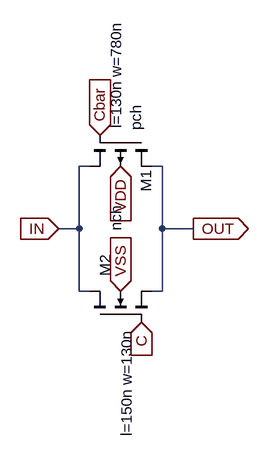
[diagram p0: schematic TG.asc]
TG.asc, the LTspice schematic file:
Version 4.1
SHEET 1 2188 680
WIRE 1920 -128 1904 -128
WIRE 2032 -128 2016 -128
WIRE 1904 -32 1904 -128
WIRE 1904 -32 1872 -32
WIRE 2032 -32 2032 -128
WIRE 2080 -32 2032 -32
WIRE 1904 64 1904 -32
WIRE 1920 64 1904 64
WIRE 2032 64 2032 -32
WIRE 2032 64 2016 64
FLAG 1936 -176 Cbar
IOPIN 1936 -176 In
FLAG 2000 112 C
IOPIN 2000 112 In
FLAG 1872 -32 IN
IOPIN 1872 -32 In
FLAG 2080 -32 OUT
IOPIN 2080 -32 Out
FLAG 1968 -128 VDD
IOPIN 1968 -128 In
FLAG 1968 64 VSS
IOPIN 1968 64 In
SYMBOL pmos4 2016 -176 R90
WINDOW 0 88 9 Right 2
WINDOW 3 -7 24 Right 2
WINDOW 123 -10 55 Right 2
SYMATTR InstName M1
SYMATTR Value pch
SYMATTR Value2 l=130n w=780n
SYMBOL nmos4 1920 112 R270
WINDOW 0 104 24 Right 2
WINDOW 3 179 41 Right 2
WINDOW 123 -10 57 Right 2
SYMATTR InstName M2
SYMATTR Value nch
SYMATTR Value2 l=150n w=130n

The netlist it stands for:
* TG.asc
M1 OUT Cbar IN VDD pch l=130n w=780n
M2 IN C OUT VSS nch l=150n w=130n
.model NMOS NMOS
.model PMOS PMOS
.lib standard.mos
.backanno
.end